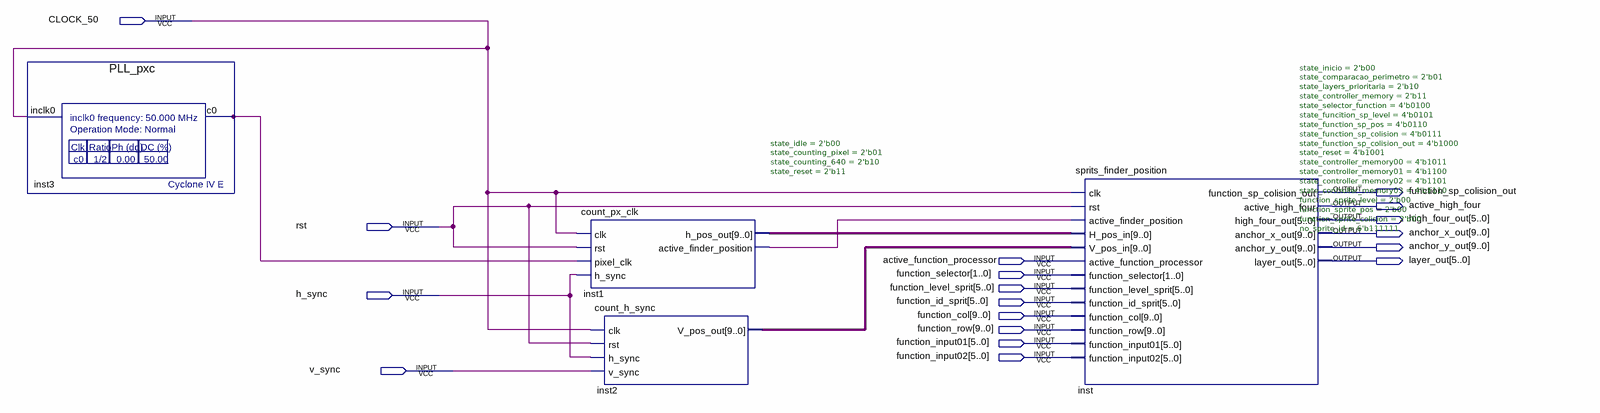
[diagram p0: schematic sheet]
// Quartus schematic modulo_sprite.bdf as structural Verilog: 4 symbols, 18 pins
module modulo_sprite (
  input  CLOCK_50,
  input  rst,
  input  active_function_processor,
  input  [1:0] function_selector,
  input  [5:0] function_level_sprit,
  input  h_sync,
  input  [5:0] function_id_sprit,
  input  [9:0] function_col,
  input  [9:0] function_row,
  input  [5:0] function_input01,
  input  [5:0] function_input02,
  input  v_sync,
  output function_sp_colision_out,
  output active_high_four,
  output [5:0] high_four_out,
  output [9:0] anchor_x_out,
  output [9:0] anchor_y_out,
  output [5:0] layer_out
);

  wire inst1_active_finder_position, inst3_c0;
  wire [9:0] inst1_h_pos_out, inst2_v_pos_out;

  PLL_pxc inst3 (.inclk0(CLOCK_50), .c0(inst3_c0));
  count_px_clk #(.state_idle(2'b00), .state_counting_pixel(2'b01), .state_counting_640(2'b10), .state_reset(2'b11)) inst1 (
    .clk(CLOCK_50), .rst(rst), .pixel_clk(inst3_c0), .h_sync(h_sync), .h_pos_out(inst1_h_pos_out),
    .active_finder_position(inst1_active_finder_position));
  count_h_sync inst2 (.clk(CLOCK_50), .rst(rst), .h_sync(h_sync), .v_sync(v_sync), .V_pos_out(inst2_v_pos_out));
  sprits_finder_position #(.state_inicio(2'b00), .state_comparacao_perimetro(2'b01), .state_layers_prioritaria(2'b10), .state_controller_memory(2'b11), .state_selector_function(4'b0100), .state_funcition_sp_level(4'b0101), .state_function_sp_pos(4'b0110), .state_function_sp_colision(4'b0111), .state_function_sp_colision_out(4'b1000), .state_reset(4'b1001), .state_controller_memory00(4'b1011), .state_controller_memory01(4'b1100), .state_controller_memory02(4'b1101), .state_controller_memory03(4'b1110), .function_sprite_level(2'b00), .function_sprite_pos(2'b00), .function_sprite_colision(2'b00), .no_sprite_id(6'b111111)) inst (
    .clk(CLOCK_50), .rst(rst), .active_finder_position(inst1_active_finder_position),
    .H_pos_in(inst1_h_pos_out), .V_pos_in(inst2_v_pos_out),
    .active_function_processor(active_function_processor), .function_selector(function_selector),
    .function_level_sprit(function_level_sprit), .function_id_sprit(function_id_sprit),
    .function_col(function_col), .function_row(function_row), .function_input01(function_input01),
    .function_input02(function_input02), .function_sp_colision_out(function_sp_colision_out),
    .active_high_four(active_high_four), .high_four_out(high_four_out), .anchor_x_out(anchor_x_out),
    .anchor_y_out(anchor_y_out), .layer_out(layer_out));
endmodule
